# EAGLE schematic riffle-base-test (EAGLE 6.5.0)
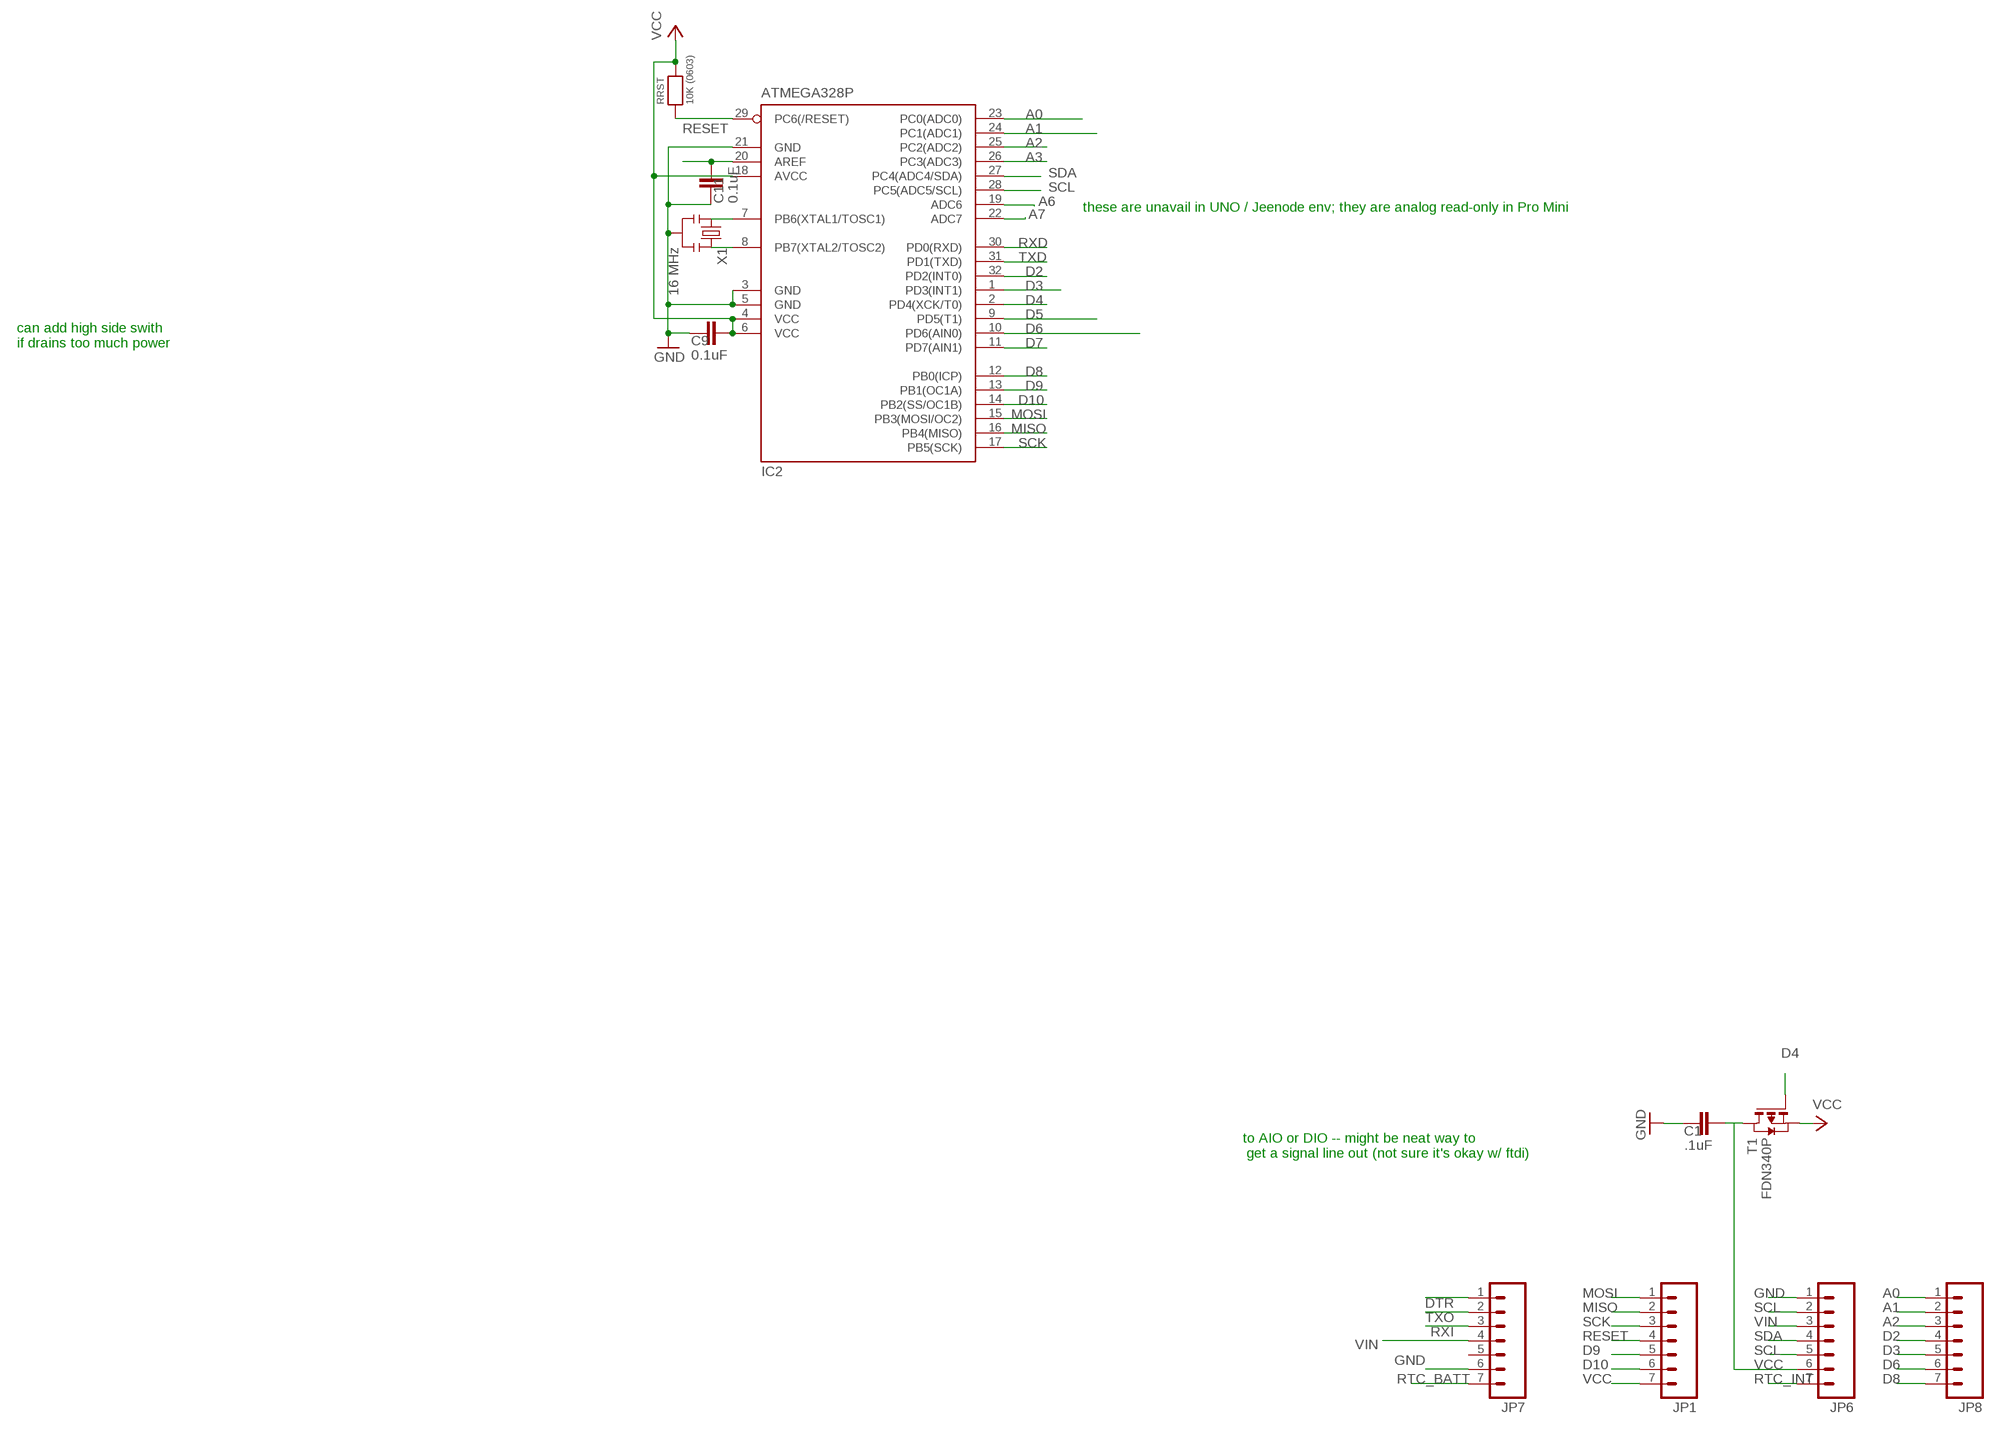
[diagram p0: schematic, sheet 1]

## Parts
C1  .1uF  C-EUC0805  [C0805@1]
C9  0.1uF  C-EUC0805  [C0805@1]
C11  0.1uF  C-EUC0805  [C0805@1]
IC2  ATMEGA328P  MEGA8-AI  [TQFP32-08]
JP1  M07  [1X07]
JP6  M07  [1X07]
JP7  M07  [1X07]
JP8  M07  [1X07]
RRST  10K (0603)  RESISTOR_0603_NOOUT  [0603-NO]
T1  FDN340P  PMOSSOT23  [SOT-23]
X1  16 MHz  RESONATORSMD  [RESONATOR-SMD]

## Nets
A0: IC2.23(PC0(ADC0)) JP8.1
A1: IC2.24(PC1(ADC1)) JP8.2
A2: IC2.25(PC2(ADC2)) JP8.3
A3: IC2.26(PC3(ADC3))
A6: IC2.19(ADC6)
A7: IC2.22(ADC7)
AREF: C11.2 IC2.20(AREF)
D2: IC2.32(PD2(INT0)) JP8.4
D3: IC2.1(PD3(INT1)) JP8.5
D4: IC2.2(PD4(XCK/T0)) T1.3(G)
D5: IC2.9(PD5(T1))
D6: IC2.10(PD6(AIN0)) JP8.6
D7: IC2.11(PD7(AIN1))
D8: IC2.12(PB0(ICP)) JP8.7
D9: IC2.13(PB1(OC1A)) JP1.5
D10: IC2.14(PB2(SS/OC1B)) JP1.6
DTR: JP7.1
GND [power]: C1.1 C9.1 C11.1 IC2.3(GND) IC2.5(GND) IC2.21(GND) JP6.1 JP7.6 X1.2
MISO: IC2.16(PB4(MISO)) JP1.2
MOSI: IC2.15(PB3(MOSI/OC2)) JP1.1
N$2: IC2.8(PB7(XTAL2/TOSC2)) X1.3
N$5: IC2.7(PB6(XTAL1/TOSC1)) X1.1
RESET: IC2.29(PC6(/RESET)) JP1.4 RRST.1
RTC_BATT: JP7.7
RTC_INT: JP6.7
RXD: IC2.30(PD0(RXD))
RXI: JP7.3
SCK: IC2.17(PB5(SCK)) JP1.3
SCL: IC2.28(PC5(ADC5/SCL)) JP6.2 JP6.5
SDA: IC2.27(PC4(ADC4/SDA)) JP6.4
TXD: IC2.31(PD1(TXD))
TXO: JP7.2
VCC: C1.2 C9.2 IC2.4(VCC) IC2.6(VCC) IC2.18(AVCC) JP1.7 JP6.6 RRST.2 T1.1(D) T1.2(S)
VIN [power]: JP6.3 JP7.4
Unconnected: JP7.5

## Notes on the sheet
- these are unavail in UNO / Jeenode env; they are analog read-only in Pro Mini
- can add high side swith
  if drains too much power
- to AIO or DIO -- might be neat way to
   get a signal line out (not sure it's okay w/ ftdi)

## Library data of the parts
C1 C9 C11 = rcl:C-EU: CAPACITOR, European symbol
IC2 = atmel:MEGA8: MICROCONTROLLER 8 Kbytes FLASH, 1 kbytes SRAM, 512 bytes EEPROM, USART, 6-channel 10 bit ADC, 2-channel 8 bit ADC Pin compatible with Atmega48, ATMega88, ATMega168 Source: avr.lbr; MPN: ATMEGA8-16AU; OC_FARNELL: 9171371; OC_NEWARK: 73M8863
JP1 JP6-JP8 = SparkFun-Connectors:M07: Header 7 Standard 7-pin 0.1" header. Use with straight break away headers (SKU : PRT-00116), right angle break away headers (PRT-00553), swiss pins (PRT-00743), machine pins (PRT-00117), and female headers (PRT-00115). NOTES ON THE VARIANTS LOCK and LOCK_LONGPADS... This footprint was designed to help hold the alignment of a through-hole component (i.e. 7-pin header) while soldering it into place. You may notice that each hole has been shifted either up or down by 0.005 of an inch from it's more standard position (which is usually a perfectly straight line). This slight alteration caused the pins (the squares in the middle) to touch the edges of the holes. Because they are alternating, it causes a "brace" to hold the header in place. 0.005 has proven to be the perfect amount of "off-center" position when using our standard breakaway headers. Although looks a little odd when you look at the bare footprint, once you have a header in there, the alteration is very hard to notice. Also, if you push a header all the way into place, it is covered up entirely on the bottom side. This idea of altering the position of holes to aid alignment will be further integrated into the Sparkfun Library for other footprints. It can help hold any component with 3 or more connection pins.
RRST = microbuilder:RESISTOR: Resistors For new designs, use the packages preceded by an '_' character since they are more reliable: The following footprints should be used on most boards: _0402 - Standard footprint for regular board layouts _0603 - Standard footprint for regular board layouts _0805 - Standard footprint for regular board layouts For extremely tight-pitch boards where space is at a premium, the following 'micro-pitch' footprints can be used (smaller pads, no silkscreen outline, etc.): _0402MP - Micro-pitch footprint for very dense/compact boards _0603MP - Micro-pitch footprint for very dense/compact boards _0805MP - Micro-pitch footprint for very dense/compact boards
T1 = zetex:PMOSSOT23: MOS FET
X1 = SparkFun:RESONATOR: Resonator Small SMD resonator. This is the itty bitty 10/20MHz resonators with built in caps. CSTCE10M0G55 and CSTCE20M0V53. Footprint has been reviewed closely but hasn't been tested yet.

## Net classes
1 power: width 0.381 mm, clearance 0.254 mm